# EAGLE design swÿtches rev1.0 (EAGLE 9.3.1)
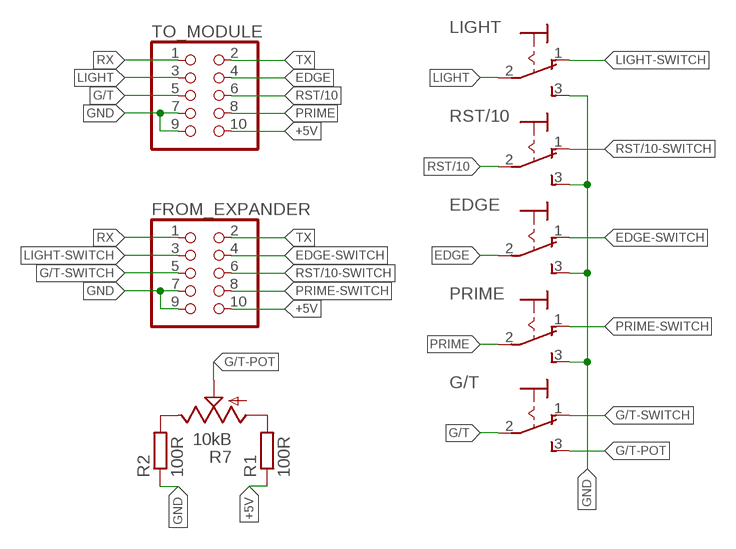
[diagram p0: schematic, sheet 1]

## Parts
EDGE  320-916320-916BIG  [320-916MY]
FROM_EXPANDER  PINHD-2X5  [2X05]
G/T  320-916320-916BIG  [320-916MY]
LIGHT  320-916320-916BIG  [320-916MY]
PRIME  320-916320-916BIG  [320-916MY]
R1  100R  R-EU_0204/7  [0204/7]
R2  100R  R-EU_0204/7  [0204/7]
R7  10kB  POT_USVERTICAL_PS  [ALPS_POT_VERTICAL_PS]
RST/10  320-916320-916BIG  [320-916MY]
TO_MODULE  PINHD-2X5  [2X05]

## Nets
+5V: FROM_EXPANDER.10 R1.1 TO_MODULE.10
EDGE: EDGE.2(P) TO_MODULE.4
EDGE-SWITCH: EDGE.1(O) FROM_EXPANDER.4
G/T: G/T.2(P) TO_MODULE.5
G/T-POT: G/T.3(S) R7.P$2(S)
G/T-SWITCH: FROM_EXPANDER.5 G/T.1(O)
GND: EDGE.3(S) FROM_EXPANDER.7 FROM_EXPANDER.9 LIGHT.3(S) PRIME.3(S) R2.1 RST/10.3(S) TO_MODULE.7 TO_MODULE.9
LIGHT: LIGHT.2(P) TO_MODULE.3
LIGHT-SWITCH: FROM_EXPANDER.3 LIGHT.1(O)
N$1: R2.2 R7.P$1(E)
N$2: R1.2 R7.P$3(A)
PRIME: PRIME.2(P) TO_MODULE.8
PRIME-SWITCH: FROM_EXPANDER.8 PRIME.1(O)
RST/10: RST/10.2(P) TO_MODULE.6
RST/10-SWITCH: FROM_EXPANDER.6 RST/10.1(O)
RX: FROM_EXPANDER.1 TO_MODULE.1
TX: FROM_EXPANDER.2 TO_MODULE.2

## Library data of the parts
EDGE G/T LIGHT PRIME RST/10 = switch:320-916: TOGGLE SWITCH distributor RS Components
FROM_EXPANDER TO_MODULE = pinhead:PINHD-2X5: PIN HEADER
R1 R2 = resistor:R-EU_: RESISTOR, European symbol
R7 = og-pots:POT_US

## Board
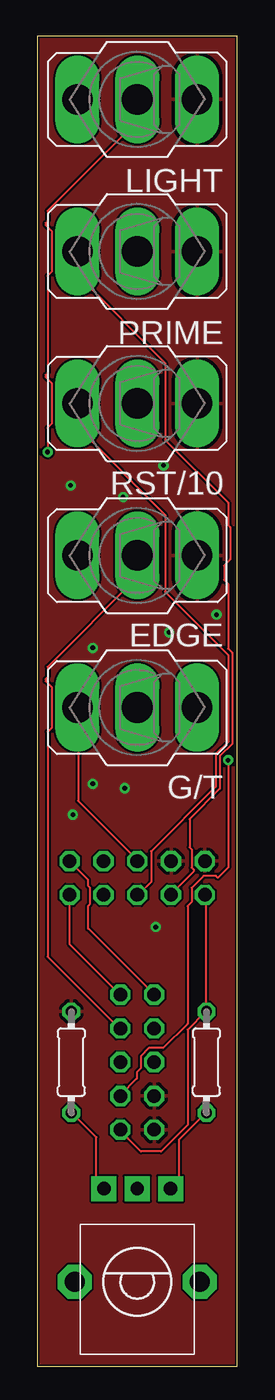
[diagram p1: board, top side]
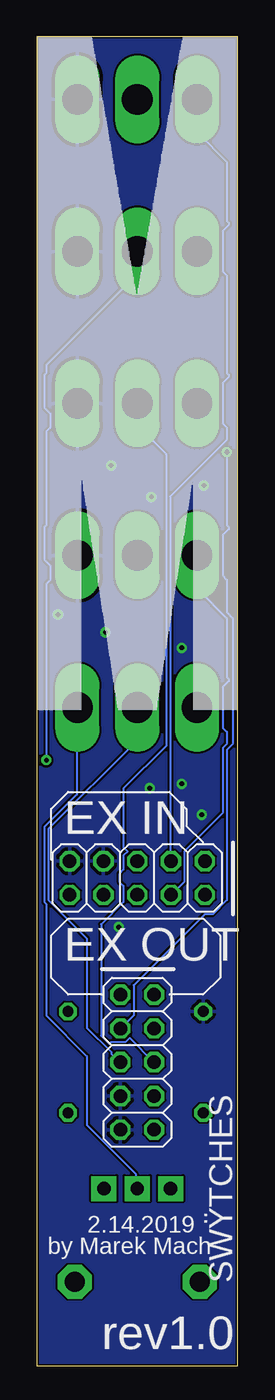
[diagram p2: board, bottom side, seen from below]

Size 15 x 100 mm. Coordinates in mm from the lower left corner, seen from the top.
Outline: 0,0 15,0 15,100 0,100 0,0
Copper layers (1*16): Top 0.035mm / dielectric 0.15mm / Bottom 0.035mm
Design rules "default *": minimum track width 6mil, minimum drill 0.35mm, track to track 6mil, track to pad 6mil, pad to pad 6mil, via to via 6mil, smd to smd 6mil, copper to edge 6mil, drill to drill 6mil, minimum pad ring 10mil, minimum via ring 8mil, stop-mask expansion 4mil, vias tented up to drill 15mil, thermal gap 10mil

### Footprints (pad centres in the part's own frame; a part is rotated, then mirrored left to right if it is on the bottom)
320-916MY = drill 2.3 long: 1 0,4.5; 2 0,0; 3 0,-4.5
2X05 = drill 1.016 octagon: 1 -5.08,-1.27; 2 -5.08,1.27; 3 -2.54,-1.27; 4 -2.54,1.27; 5 0,-1.27; 6 0,1.27; 7 2.54,-1.27; 8 2.54,1.27; 9 5.08,-1.27; 10 5.08,1.27
0204/7 = drill 0.813 octagon: 1 -3.81,0; 2 3.81,0
ALPS_POT_VERTICAL_PS = drill 1 pad 1.88 square: P$1 -2.5,7; P$2 0,7; P$3 2.5,7 | drill 1.5 pad 2.54 octagon: P$4 -4.7,0; P$5 4.7,0

### Placement (x,y rotation side)
EDGE  7.5,60.96 90 top
FROM_EXPANDER  7.5,36.71 180 bottom
G/T  7.5,49.53 90 top
LIGHT  7.5,95.25 90 top
PRIME  7.5,83.82 90 top
R1  12.7,22.86 270 top
R2  2.54,22.86 270 top
R7  7.5,6.35 0 top
RST/10  7.5,72.39 90 top
TO_MODULE  7.5,22.86 270 bottom

### Tracks (layer width: path | path; a pad name or v marks a point on that pad's centre or on a via)
+5V
  Top 0.152: 12.65,26.67 12.65,35.36 FROM_EXPANDER.10 | 12.65,26.67 11.28,25.3 11.28,18.14 9.3,16.15 7.77,16.15 6.25,17.68 TO_MODULE.10 | 12.65,26.67 R1.1
EDGE
  Top 0.152: TO_MODULE.4 6.1,25.45 0.76,30.79 0.76,47.7 1.07,48.01 1.07,51.05 0.61,51.51 0.61,51.66 0.76,51.82 0.76,52.58 7.47,59.28 7.47,60.96 EDGE.2
EDGE-SWITCH
  Bottom 0.152: FROM_EXPANDER.4 4.88,35.51 3.96,36.42 3.96,38.71 1.07,41.6 1.07,46.48 0.76,46.79 0.76,47.7 1.07,48.01 1.07,51.05 0.61,51.51 0.61,51.66 0.76,51.82 0.76,56.24 2.9,58.37 2.9,60.96 EDGE.1
G/T
  Bottom 0.152: TO_MODULE.5 8.84,22.86 9.45,23.47 9.45,23.62 11.28,25.45 11.28,32.16 14.17,35.05 14.17,40.39 7.62,46.94 7.62,49.53 G/T.2
G/T-POT
  Bottom 0.152: R7.P$2 7.62,13.41 7.62,14.48 11.28,18.14 11.28,23.32 14.33,26.36 14.33,34.75 14.48,34.9 14.48,40.54 12.04,42.98 12.04,49.53 G/T.3
G/T-SWITCH
  Top 0.152: FROM_EXPANDER.5 7.47,38.1 3.05,42.52 3.05,49.53 G/T.1
GND  (via drill 0.35)
  other vias: 2.66,41.47 4.15,43.79 6.56,43.46 8.89,33.02 4.15,54.02 13.46,56.51 2.49,66.23 9.47,67.73 6.44,65.36 9.9,55.19
  pour Top: 0,100 0,0 15,0 15,100
  pour Bottom: 0,100 0,0 15,0 15,100
LIGHT  (via drill 0.35)
  Top 0.152: v0.76,68.73 0.76,70.56 1.07,70.87 1.07,73.91 0.61,74.37 0.61,74.52 0.76,74.68 0.76,81.99 1.07,82.3 1.07,85.34 0.61,85.8 0.61,85.95 0.76,86.11 0.76,86.87 7.47,93.57 7.47,95.25 LIGHT.2
  Bottom 0.152: v0.76,68.73 0.76,63.25 0.61,63.09 0.61,62.94 1.07,62.48 1.07,59.44 0.76,59.13 0.76,56.69 0.3,56.24 0.3,46.79 0.76,46.33 0.76,35.05 1.83,33.98 2.44,33.98 7.77,28.65 7.77,26.36 8.69,25.45 TO_MODULE.3
LIGHT-SWITCH
  Bottom 0.152: FROM_EXPANDER.3 5.03,38.1 5.03,65.38 0.76,69.65 0.76,70.56 1.07,70.87 1.07,73.91 0.61,74.37 0.61,74.52 0.76,74.68 0.76,81.99 1.07,82.3 1.07,85.34 0.61,85.8 0.61,85.95 0.76,86.11 0.76,90.53 2.9,92.66 2.9,95.25 LIGHT.1
N$1
  Top 0.152: R2.2 2.59,19.05 4.42,17.22 4.42,13.87 4.88,13.41 R7.P$1
N$2
  Top 0.152: R1.2 12.65,19.05 10.67,17.07 10.67,14.02 10.06,13.41 R7.P$3
PRIME  (via drill 0.35)
  Top 0.152: v14.33,45.57 14.33,37.49 13.56,36.73 13.41,36.88 12.5,36.88 11.58,35.97 11.58,34.9 11.28,34.59 11.28,25.76 9.45,23.93 8.38,23.93 7.77,23.32 7.77,22.4 7.47,22.1 7.47,21.64 6.25,20.42 TO_MODULE.8
  Bottom 0.152: v14.33,45.57 14.33,58.83 14.02,59.13 14.02,60.2 14.48,60.66 14.48,63.09 14.33,63.25 14.33,70.26 14.02,70.56 14.02,71.63 14.48,72.08 14.48,74.52 14.33,74.68 14.33,75.29 7.62,81.99 7.62,83.82 PRIME.2
PRIME-SWITCH
  Top 0.152: FROM_EXPANDER.8 10.06,35.51 11.73,37.19 11.73,37.34 11.58,37.49 11.58,38.86 11.43,39.01 11.43,41.15 13.72,43.43 13.72,45.87 14.63,46.79 14.63,53.65 14.33,53.95 14.33,58.83 14.02,59.13 14.02,60.2 14.48,60.66 14.48,63.09 14.33,63.25 14.33,64.92 9.6,69.65 9.6,75.44 3.05,81.99 3.05,83.82 PRIME.1
RST/10
  Bottom 0.152: TO_MODULE.6 6.25,22.86 8.08,24.69 8.38,24.38 9.45,24.38 9.6,24.23 10.21,24.84 10.21,33.22 8.53,34.9 8.53,36.12 8.84,36.42 8.84,37.03 8.53,37.34 8.53,38.41 8.23,38.71 8.53,39.01 8.53,43.43 5.33,46.63 5.33,68.58 7.47,70.71 7.47,72.39 RST/10.2
RST/10-SWITCH
  Top 0.152: FROM_EXPANDER.6 7.62,35.51 8.53,36.42 8.53,38.71 13.41,43.59 13.41,46.02 14.33,46.94 14.33,53.49 9.6,58.22 9.6,64.01 3.05,70.56 3.05,72.39 RST/10.1
RX
  Top 0.152: FROM_EXPANDER.1 2.44,37.95 3.81,36.58 3.81,36.12 3.96,35.97 3.96,34.75 3.81,34.59 3.81,32.92 8.69,28.04 TO_MODULE.1
TX
  Top 0.152: FROM_EXPANDER.2 2.44,35.36 2.44,31.7 6.1,28.04 TO_MODULE.2

### Text on the board
bNames: F:/eurorack-master/M black logo 3hp 2000dpi.bmp | EX IN | EX OUT | 2.14.2019 | by Marek Mach | SWŸTCHES | rev1.0